# Altium schematic sheet Switch.SchDoc
size Tabloid
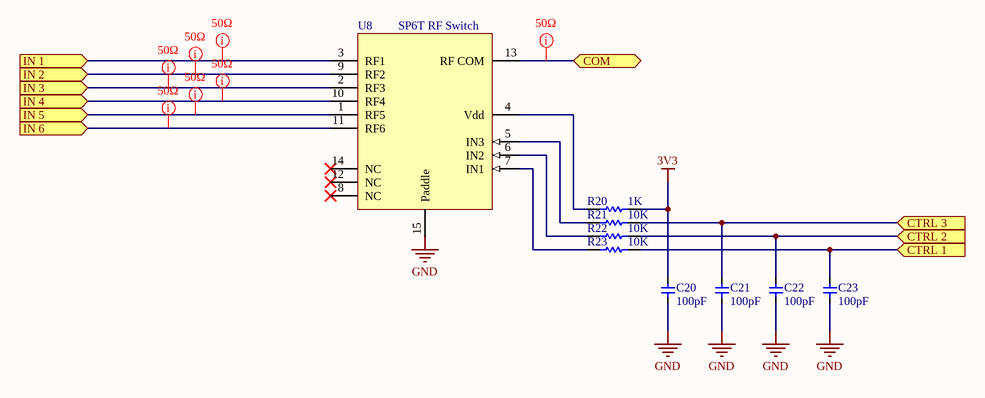
[diagram p0: Switch.SchDoc]

## Parts
C20  value 100pF  [0603C]  (hidden comment: SMT Cap)
C21  value 100pF  [0603C]  (hidden comment: SMT Cap)
C22  value 100pF  [0603C]  (hidden comment: SMT Cap)
C23  value 100pF  [0603C]  (hidden comment: SMT Cap)
R20  value 1K  [0603R]  (hidden comment: RES Semi)
R21  value 10K  [0603R]  (hidden comment: RES Semi)
R22  value 10K  [0603R]  (hidden comment: RES Semi)
R23  value 10K  [0603R]  (hidden comment: RES Semi)
U8  SP6T RF Switch  [MT1817]

## Ports
COM (bidir), CTRL 1 (in), CTRL 2 (in), CTRL 3 (in), IN 1 (in), IN 2 (in), IN 3 (in), IN 4 (in), IN 5 (in), IN 6 (in)

## Nets
3V3: C20.2 R20.2
GND: C20.1 C21.1 C22.1 C23.1 U8.15(Paddle)
COM: U8.13(RF_COM) ; port COM
CTRL 1: C23.2 R23.2 ; port CTRL 1
CTRL 2: C22.2 R22.2 ; port CTRL 2
CTRL 3: C21.2 R21.2 ; port CTRL 3
IN 1: U8.3(RF1) ; port IN 1
IN 2: U8.9(RF2) ; port IN 2
IN 3: U8.2(RF3) ; port IN 3
IN 4: U8.10(RF4) ; port IN 4
IN 5: U8.1(RF5) ; port IN 5
IN 6: U8.11(RF6) ; port IN 6
NetR20_1: R20.1 U8.4(Vdd)
NetR21_1: R21.1 U8.5(IN3)
NetR22_1: R22.1 U8.6(IN2)
NetR23_1: R23.1 U8.7(IN1)

Not connected (* = marked no-connect by the designer): U8 8(NC)* 12(NC)* 14(NC)*

## Layout directives
rule Width Constraint [Pref Impedance = 50.00ohms    Min Impedance = 45.00ohms    Max Impedance = 70.00ohms]: COM, IN 1, IN 2, IN 3, IN 4, IN 5, IN 6

## Notes on the sheet
- Title
- Size:
- Date:
- Tabloid
- Number:
- Time:
- Revision:
- Sheet
- of
- File:

## Library data of the parts
C20-C23 = Cap - SMT Small: Published: 8-Jun-2000; LatestRevisionDate: 29-May-2009; LatestRevisionNote: IPC-7351 Footprint Added.; PackageReference: C1206; Publisher: Altium Limited; PackageDescription: Chip Capacitor
R20-R23 = RES Semi: Semiconductor Resistor; Published: 8-Jun-2000; LatestRevisionDate: 17-Jul-2002; LatestRevisionNote: Re-released for DXP Platform.; PackageReference: AXIAL-0.5; Publisher: Altium Limited
U8 = JSW6-33DR+: SP6T RF Switch 50Ω 10 to 2700 MHz